# Altium schematic sheet Power.SchDoc
size A4
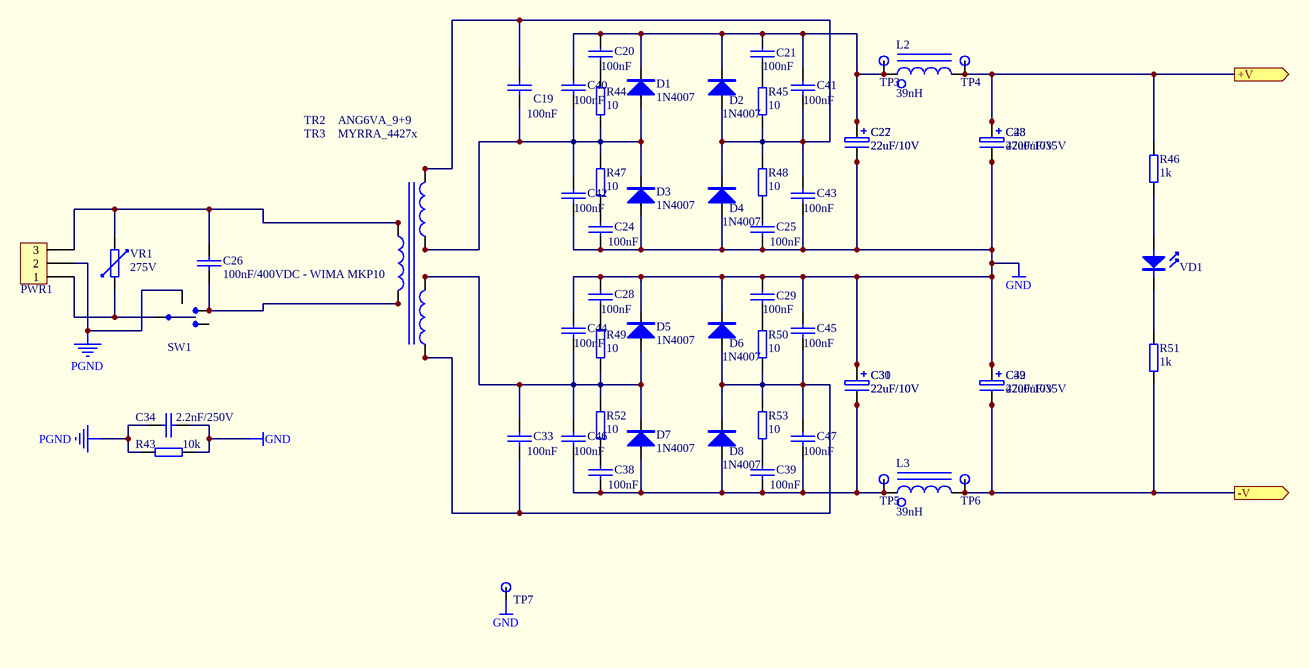
[diagram p0: Power.SchDoc]

## Parts
C19  100nF  [CAP_C200-1]
C20  100nF  [CAP_C200]
C21  100nF  [CAP_C200]
C22  22uF/10V  [CAP_EC10x20]
C23  4700uF/35V  [CAP_EC22x40]
C24  100nF  [CAP_C200]
C25  100nF  [CAP_C200]
C26  100nF/400VDC - WIMA MKP10  [CAP_5.7x10.3RM7.5]
C27  22uF/10V  [CAP_EC22x40]
C28  100nF  [CAP_C200]
C29  100nF  [CAP_C200]
C30  22uF/10V  [CAP_EC10x20]
C31  22uF/10V  [CAP_EC22x40]
C32  4700uF/35V  [CAP_EC22x40]
C33  100nF  [CAP_C200-1]
C34  2.2nF/250V  [CAP_5.7x10.3RM7.5]
C38  100nF  [CAP_C200]
C39  100nF  [CAP_C200]
C40  100nF  [CAP_C200]
C41  100nF  [CAP_C200]
C42  100nF  [CAP_C200]
C43  100nF  [CAP_C200]
C44  100nF  [CAP_C200]
C45  100nF  [CAP_C200]
C46  100nF  [CAP_C200]
C47  100nF  [CAP_C200]
C48  22uF/10V  [CAP_EC10x20]
C49  22uF/10V  [CAP_EC10x20]
D1  1N4007  [DIODE_D400]
D2  1N4007  [DIODE_D400]
D3  1N4007  [DIODE_D400]
D4  1N4007  [DIODE_D400]
D5  1N4007  [DIODE_D400]
D6  1N4007  [DIODE_D400]
D7  1N4007  [DIODE_D400]
D8  1N4007  [DIODE_D400]
L2  39nH  [IND_SRI1205]
L3  39nH  [IND_SRI1205]
PWR1  CON3  [CON_TOP_3P]  (value not drawn)
R43  10k  [RES_R400]
R44  10  [RES_R400]
R45  10  [RES_R400]
R46  1k  [RES_R400]
R47  10  [RES_R400]
R48  10  [RES_R400]
R49  10  [RES_R400]
R50  10  [RES_R400]
R51  1k  [RES_R400]
R52  10  [RES_R400]
R53  10  [RES_R400]
SW1  SW  [SW_250VAC1.5A]  (value not drawn)
TP3  TESTPAD  [MISC_PAD-36/65]  (value not drawn)
TP4  TESTPAD  [MISC_PAD-36/65]  (value not drawn)
TP5  TESTPAD  [MISC_PAD-36/65]  (value not drawn)
TP6  TESTPAD  [MISC_PAD-36/65]  (value not drawn)
TP7  TESTPAD  [MISC_PAD-36/65]  (value not drawn)
TR2  ANG6VA_9+9  [TRAF_ANG6VA]
TR3  MYRRA_4427x  [TRAF_MYRRA_10VA]
VD1  LED  [LED_5MM]  (value not drawn)
VR1  275V  [MISC_Varistor]

## Ports
+V (out), -V (out)

## Nets
GND: C22.2 C23.2 C24.2 C25.2 C27.2 C28.1 C29.1 C30.1 C31.1 C32.1 C34.2 C42.2 C43.2 C44.1 C45.1 C48.2 C49.1 D3.1(A) D4.1(A) D5.2(K) D6.2(K) R43.2 TP7.1
PGND: C34.1 PWR1.2 R43.1 SW1.0
+V: C23.1 C48.1 L2.2 R46.2 TP4.1 ; port +V
-V: C32.2 C49.2 L3.2 R51.1 TP6.1 ; port -V
NetC19_1: C19.1 C41.2 C43.1 D2.1(A) D4.2(K) R45.1 R48.2 TR2.10 TR3.12
NetC19_2: C19.2 C40.2 C42.1 D1.1(A) D3.2(K) R44.1 R47.2 TR2.9 TR3.11
NetC20_1: C20.1 C21.1 C22.1 C27.1 C40.1 C41.1 D1.2(K) D2.2(K) L2.1 TP3.1
NetC20_2: C20.2 R44.2
NetC21_2: C21.2 R45.2
NetC24_1: C24.1 R47.1
NetC25_1: C25.1 R48.1
NetC26_1: C26.1 SW1.3 TR2.1 TR3.6
NetC26_2: C26.2 PWR1.3 TR2.5 TR3.1 VR1.1
NetC28_2: C28.2 R49.2
NetC29_2: C29.2 R50.2
NetC30_2: C30.2 C31.2 C38.2 C39.2 C46.2 C47.2 D7.1(A) D8.1(A) L3.1 TP5.1
NetC33_1: C33.1 C44.2 C46.1 D5.1(A) D7.2(K) R49.1 R52.2 TR2.7 TR3.8
NetC33_2: C33.2 C45.2 C47.1 D6.1(A) D8.2(K) R50.1 R53.2 TR2.6 TR3.7
NetC38_1: C38.1 R52.1
NetC39_1: C39.1 R53.1
NetPWR1_1: PWR1.1 SW1.2 VR1.2
NetR46_1: R46.1 VD1.1(A1)
NetR51_2: R51.2 VD1.2(K)

Not connected (* = marked no-connect by the designer): SW1 1

## Library data of the parts
C19-C21 C24-C26 C28 C29 C33 C34 C38-C47 = CAP: Capacitor
C22 C23 C27 C30-C32 C48 C49 = ELECTRO1: Electrolytic Capacitor
D1-D8 = DIODE
L2 L3 = INDUCTOR IRON1
PWR1 = CON3: Connector
R43-R53 = RES: Resistor
SW1 = SW_2WAY
TR2 = TRAF_ANG6VAx+x
TR3 = TRAF_MYRRA_10VA_D
VD1 = LED: LED, 3mm
VR1 = VARISTOR: Resistor